# Altium schematic sheet MCU_Src.SchDoc
size A4; SheetNumber: 2; SheetTotal: 2
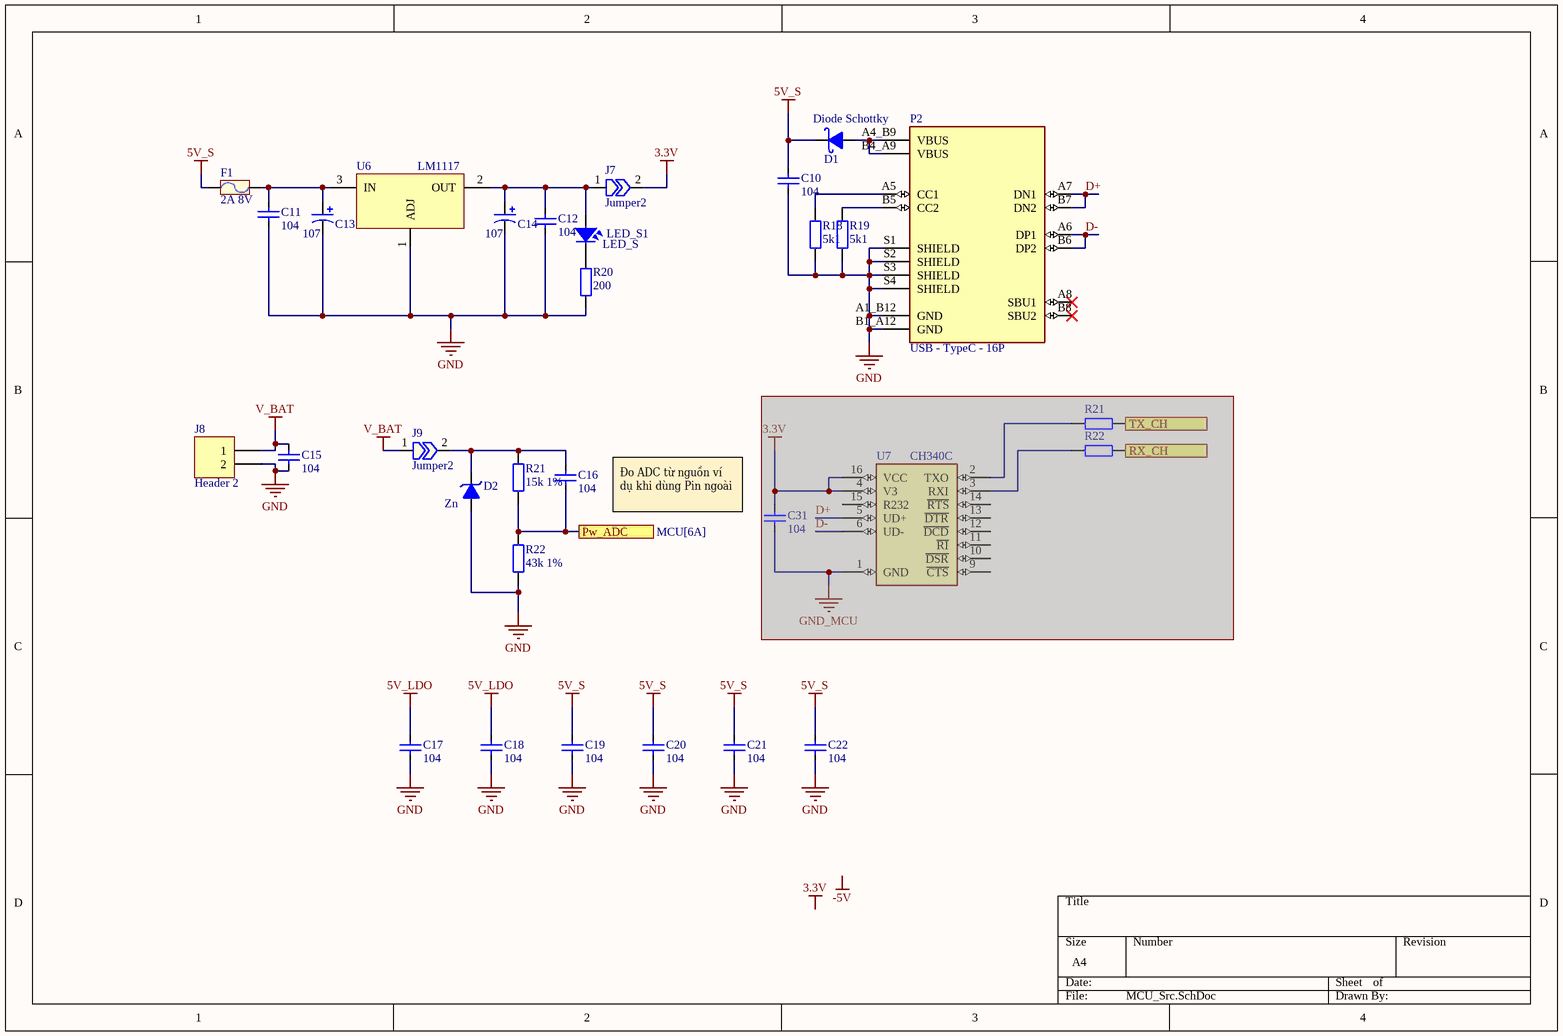
[diagram p0: MCU_Src.SchDoc]

## Parts
(Parts that share a designator on the sheet are numbered #1, #2 ... from top to bottom, then left to right.)
C10  104  [CAP_0603]
C11  104  [CAP_0603]
C12  104  [CAP_0603]
C13  107  [CAP_7343]
C14  107  [CAP_7343]
C15  104  [CAP_0603]
C16  104  [CAP_0603]
C17  104  [CAP_0603]
C18  104  [CAP_0603]
C19  104  [CAP_0603]
C20  104  [CAP_0603]
C21  104  [CAP_0603]
C22  104  [CAP_0603]
C31  104  [CAP_0603]  (graphical)  (masked out: inside a compile mask, not in the netlist)
D1  Diode Schottky  [DIO-214AA(SMB)]
D2  Zn  [DIODE_ZENER_SMD]
F1  2A 8V  [RES-SMD-1812]
J7  Jumper2  [RES-SMD-0402]  (net tie, no BOM)
J8  Header 2  [HDR1X2]
J9  Jumper2  [RES-SMD-0201]
LED_S1  LED_S  [LED-0805-Blue]
P2  USB - TypeC - 16P  [USB C 16P]
R18  5k1  [RES-SMD-0805]
R19  5k1  [RES-SMD-0805]
R20  200  [RES-SMD-0603]
R21#1  0R  [RES-SMD-0805]  (value not drawn)  (graphical)  (masked out: inside a compile mask, not in the netlist)
R21#2  15k 1%  [RES-SMD-0603]
R22#1  0R  [RES-SMD-0805]  (value not drawn)  (graphical)  (masked out: inside a compile mask, not in the netlist)
R22#2  43k 1%  [RES-SMD-0603]
U6  LM1117  [SOT-223]
U7  CH340C  [SOP-16]  (graphical)  (masked out: inside a compile mask, not in the netlist)

## Ports
Pw_ADC (see MCU[6A]), RX_CH, TX_CH

## Nets
3.3V: J7.2
5V_LDO: C17.2 C18.2
5V_S: C10.2 C19.2 C20.2 C21.2 C22.2 D1.2(K) F1.1
GND: C10.1 C11.1 C12.1 C13.2 C14.2 C15.1 C17.1 C18.1 C19.1 C20.1 C21.1 C22.1 D2.1(A) J8.2 P2.A1_B12(GND) P2.B1_A12(GND) P2.S1(SHIELD) P2.S2(SHIELD) P2.S3(SHIELD) P2.S4(SHIELD) R18.2 R19.2 R20.2 R22#2.2 U6.1(ADJ)
V_BAT: C15.2 J8.1 J9.1
D+: P2.A7(DN1) P2.B7(DN2)
D-: P2.A6(DP1) P2.B6(DP2)
Pw_ADC: C16.1 R21#2.2 R22#2.1 ; port Pw_ADC
NetC11_2: C11.2 C13.1 F1.2 U6.3(IN)
NetC12_2: C12.2 C14.1 J7.1 LED_S1.1 U6.2(OUT)
NetC16_2: C16.2 D2.2(K) J9.2 R21#2.1
NetD1_1: D1.1(A) P2.A4_B9(VBUS) P2.B4_A9(VBUS)
NetLED_S1_2: LED_S1.2 R20.1
NetP2_A5: P2.A5(CC1) R18.1
NetP2_B5: P2.B5(CC2) R19.1

Not connected (* = marked no-connect by the designer): P2 A8(SBU1)* B8(SBU2)*

## Notes on the sheet
- Đo ADC từ nguồn ví dụ khi dùng Pin ngoài
- Labels drawn without touching a wire or pin: 3.3V, -5V

## Library data of the parts
C10 = CapSMD: Capacitor; Value: 33p; Published: 8-Jun-2000; LatestRevisionDate: 17-Jul-2002; LatestRevisionNote: Re-released for DXP Platform.; PackageReference: RAD-0.3; Publisher: Altium Limited
C11 C12 C15-C22 C31 = CapSMD: Capacitor SMD 0603; Value: 33p; Published: 8-Jun-2000; LatestRevisionDate: 17-Jul-2002; LatestRevisionNote: Re-released for DXP Platform.; PackageReference: RAD-0.3; Publisher: Altium Limited
C13 C14 = CAP_TAN_SMD: Polazied Tantalum Capacitor
D1 = Diode Schottky: SS34
D2 = Zenner: generic zenner diode
F1 = Fuse: https://linhkien.cxtvn.com/5126-cau-chi-tu-phuc-hoi-pptc-2a-8v-smd1812.html; Value: Fuse; Designed by: VanDungEvn
J7 J9 = Jumper2: Jumper, 2-Pin
J8 = Header 2: Header, 2-Pin; LatestRevisionDate: 17-Jul-2002; LatestRevisionNote: Re-released for DXP Platform.; Publisher: Altium Limited
LED_S1 = LED: LED Single colour Green and Red; Value: LED 3 ly Single Colour
R18 R19 R21#1 R22#1 = Resistor - SMD: Resistor SMD; Manufacturer: Generic Components; Class: Passive; Published: 08/06/2000; Publisher: Altium Hobart Technology Centre
R20 R21#2 R22#2 = Resistor - SMD: Resistor SMD 0603; Manufacturer: Generic Components; Class: Passive; Published: 08/06/2000; Publisher: Altium Hobart Technology Centre
U6 = LM1117: 3V3 5V LDO, AMS1117, LDI1117; Creator: Nguyen Ba Bien; Website: http://group3i.net
U7 = CH340C: USB to serial chip CH340; MF: WCH; Package: Package; Check_prices: https://www.snapeda.com/parts/CH340C/WCH/view-part/5428851/?ref=eda; Value: *; Price: None; MP: CH340C; Availability: Unavailable; SnapEDA_Link: https://www.snapeda.com/parts/CH340C/WCH/view-part/5428851/?ref=snap
P2 = USB - TypeC - 16P: ComponentLink1Description: New link; ComponentLink1URL: https://linhkien.cxtvn.com/6914-cong-type-c-cai-16p-usb-31-v2.html